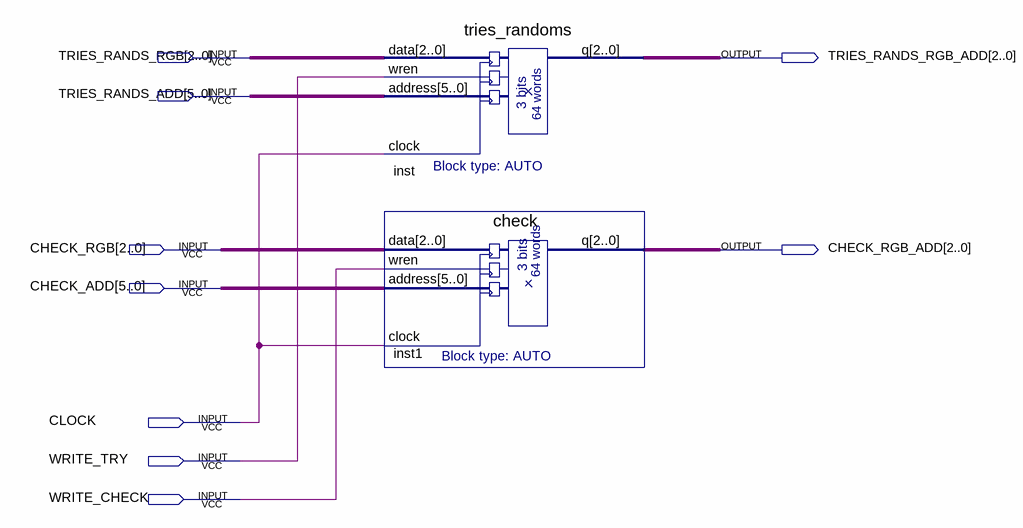
[diagram p0: schematic sheet]
// Quartus schematic register_file.bdf as structural Verilog: 2 symbols, 9 pins
module register_file (
  input  [2:0] TRIES_RANDS_RGB,
  input  [5:0] TRIES_RANDS_ADD,
  input  [2:0] CHECK_RGB,
  input  [5:0] CHECK_ADD,
  input  CLOCK,
  input  WRITE_TRY,
  input  WRITE_CHECK,
  output [2:0] TRIES_RANDS_RGB_ADD,
  output [2:0] CHECK_RGB_ADD
);

  tries_randoms inst (
    .data(TRIES_RANDS_RGB), .wren(WRITE_TRY), .address(TRIES_RANDS_ADD), .clock(CLOCK),
    .q(TRIES_RANDS_RGB_ADD));
  check inst1 (.data(CHECK_RGB), .wren(WRITE_CHECK), .address(CHECK_ADD), .clock(CLOCK), .q(CHECK_RGB_ADD));
endmodule
